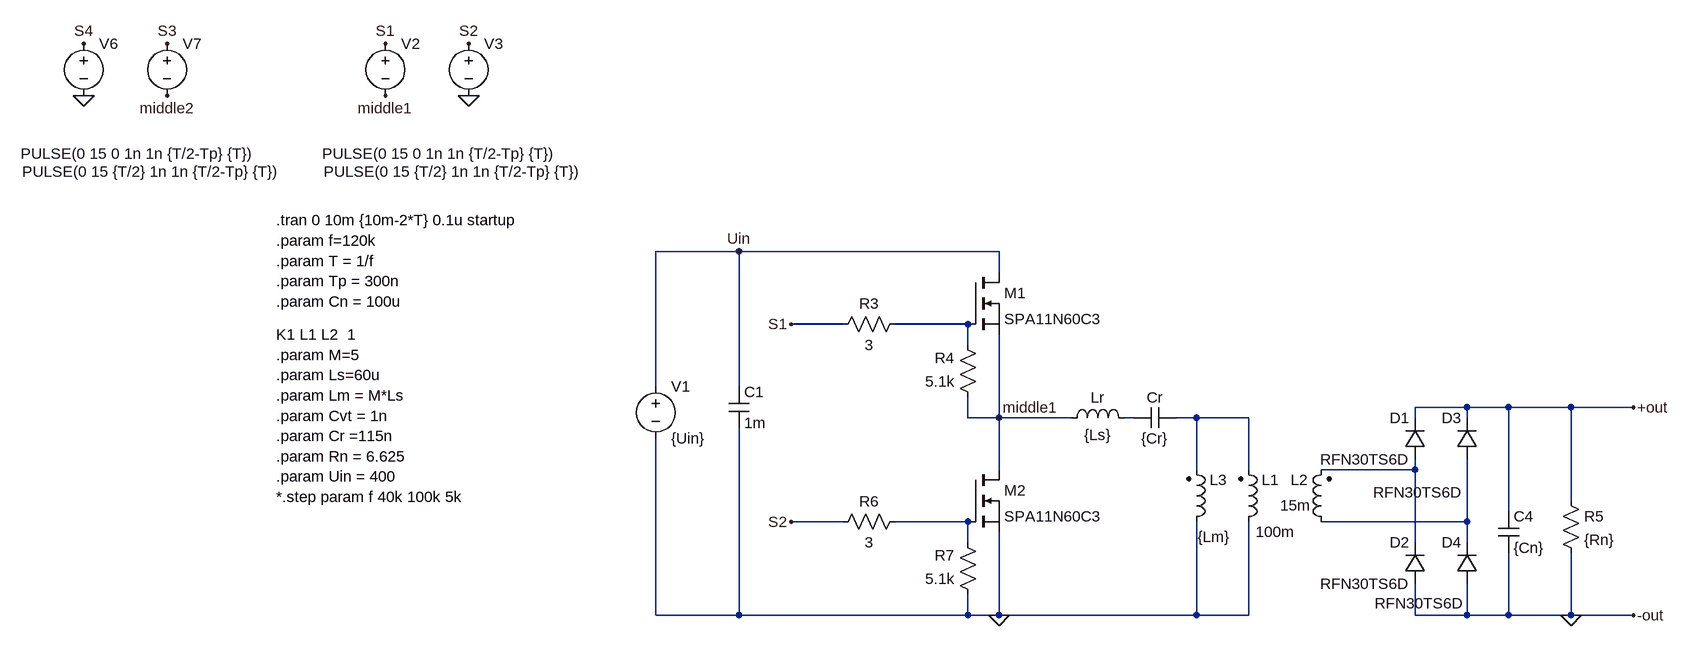
[diagram p0: schematic LLC_skhema.asc]
LLC_skhema.asc, the LTspice schematic file:
Version 4
SHEET 1 1788 964
WIRE -352 -800 -480 -800
WIRE 48 -800 -352 -800
WIRE 48 -768 48 -800
WIRE -192 -688 -272 -688
WIRE 0 -688 -112 -688
WIRE 0 -656 0 -688
WIRE -480 -592 -480 -800
WIRE -352 -592 -352 -800
WIRE 768 -560 688 -560
WIRE 832 -560 768 -560
WIRE 928 -560 832 -560
WIRE 1024 -560 928 -560
WIRE 0 -544 0 -576
WIRE 48 -544 48 -672
WIRE 48 -544 0 -544
WIRE 160 -544 48 -544
WIRE 256 -544 240 -544
WIRE 352 -544 320 -544
WIRE 432 -544 352 -544
WIRE 688 -544 688 -560
WIRE 768 -544 768 -560
WIRE 48 -464 48 -544
WIRE 352 -464 352 -544
WIRE 432 -464 432 -544
WIRE 688 -464 688 -480
WIRE 688 -464 544 -464
WIRE 928 -416 928 -560
WIRE 832 -400 832 -560
WIRE -192 -384 -272 -384
WIRE 0 -384 -112 -384
WIRE 768 -384 768 -480
WIRE 768 -384 544 -384
WIRE 0 -352 0 -384
WIRE 688 -352 688 -464
WIRE 768 -352 768 -384
WIRE -480 -240 -480 -512
WIRE -352 -240 -352 -528
WIRE -352 -240 -480 -240
WIRE 0 -240 0 -272
WIRE 0 -240 -352 -240
WIRE 48 -240 48 -368
WIRE 48 -240 0 -240
WIRE 352 -240 352 -384
WIRE 352 -240 48 -240
WIRE 432 -240 432 -384
WIRE 432 -240 352 -240
WIRE 688 -240 688 -288
WIRE 768 -240 768 -288
WIRE 768 -240 688 -240
WIRE 832 -240 832 -336
WIRE 832 -240 768 -240
WIRE 928 -240 928 -336
WIRE 928 -240 832 -240
WIRE 1024 -240 928 -240
FLAG -896 -1120 S1
FLAG -768 -1120 S2
FLAG -272 -688 S1
FLAG -272 -384 S2
FLAG 48 -544 middle1
FLAG -896 -1040 middle1
FLAG -768 -1040 0
FLAG 48 -240 0
FLAG -352 -800 Uin
FLAG -1360 -1120 S4
FLAG -1232 -1120 S3
FLAG -1232 -1040 middle2
FLAG -1360 -1040 0
FLAG 1024 -560 +out
FLAG 1024 -240 -out
FLAG 928 -240 0
SYMBOL voltage -480 -608 R0
WINDOW 123 0 0 Left 2
WINDOW 39 0 0 Left 2
SYMATTR InstName V1
SYMATTR Value {Uin}
SYMBOL cap -368 -592 R0
SYMATTR InstName C1
SYMATTR Value 1m
SYMBOL ind2 336 -368 M180
WINDOW 0 36 80 Left 2
WINDOW 3 18 -7 Left 2
SYMATTR InstName L3
SYMATTR Value {Lm}
SYMATTR Type ind
SYMBOL ind2 416 -368 M180
WINDOW 0 36 80 Left 2
WINDOW 3 27 0 Left 2
SYMATTR InstName L1
SYMATTR Value 100m
SYMATTR Type ind
SYMBOL ind 144 -528 R270
WINDOW 0 32 56 VTop 2
WINDOW 3 5 56 VBottom 2
SYMATTR InstName Lr
SYMATTR Value {Ls}
SYMBOL voltage -896 -1136 R0
WINDOW 123 0 0 Left 2
WINDOW 39 0 0 Left 2
WINDOW 3 -97 185 Left 2
SYMATTR Value PULSE(0 15 0 1n 1n {T/2-Tp} {T})
SYMATTR InstName V2
SYMBOL voltage -768 -1136 R0
WINDOW 123 0 0 Left 2
WINDOW 39 0 0 Left 2
WINDOW 3 -223 213 Left 2
SYMATTR Value PULSE(0 15 {T/2} 1n 1n {T/2-Tp} {T})
SYMATTR InstName V3
SYMBOL nmos 0 -768 R0
SYMATTR InstName M1
SYMATTR Value SPA11N60C3
SYMBOL cap 320 -560 R90
WINDOW 0 0 32 VBottom 2
WINDOW 3 32 32 VTop 2
SYMATTR InstName Cr
SYMATTR Value {Cr}
SYMBOL res -96 -704 R90
WINDOW 0 0 56 VBottom 2
WINDOW 3 32 56 VTop 2
SYMATTR InstName R3
SYMATTR Value 3
SYMBOL res 16 -560 R180
WINDOW 0 36 76 Left 2
WINDOW 3 36 40 Left 2
SYMATTR InstName R4
SYMATTR Value 5.1k
SYMBOL res -96 -400 R90
WINDOW 0 0 56 VBottom 2
WINDOW 3 32 56 VTop 2
SYMATTR InstName R6
SYMATTR Value 3
SYMBOL res 16 -256 R180
WINDOW 0 36 76 Left 2
WINDOW 3 36 40 Left 2
SYMATTR InstName R7
SYMATTR Value 5.1k
SYMBOL voltage -1360 -1136 R0
WINDOW 123 0 0 Left 2
WINDOW 39 0 0 Left 2
WINDOW 3 -97 185 Left 2
SYMATTR Value PULSE(0 15 0 1n 1n {T/2-Tp} {T})
SYMATTR InstName V6
SYMBOL voltage -1232 -1136 R0
WINDOW 123 0 0 Left 2
WINDOW 39 0 0 Left 2
WINDOW 3 -223 213 Left 2
SYMATTR Value PULSE(0 15 {T/2} 1n 1n {T/2-Tp} {T})
SYMATTR InstName V7
SYMBOL nmos 0 -464 R0
SYMATTR InstName M2
SYMATTR Value SPA11N60C3
SYMBOL ind2 560 -368 R180
WINDOW 0 36 80 Left 2
WINDOW 3 32 41 Left 2
SYMATTR InstName L2
SYMATTR Value 15m
SYMATTR Type ind
SYMBOL res 912 -432 R0
SYMATTR InstName R5
SYMATTR Value {Rn}
SYMBOL cap 816 -400 R0
SYMATTR InstName C4
SYMATTR Value {Cn}
SYMBOL diode 704 -480 R180
WINDOW 0 24 64 Left 2
WINDOW 3 24 0 Left 2
SYMATTR InstName D1
SYMATTR Value RFN30TS6D
SYMBOL diode 704 -288 R180
WINDOW 0 24 64 Left 2
WINDOW 3 24 0 Left 2
SYMATTR InstName D2
SYMATTR Value RFN30TS6D
SYMBOL diode 784 -480 R180
WINDOW 0 24 64 Left 2
WINDOW 3 22 -51 Left 2
SYMATTR InstName D3
SYMATTR Value RFN30TS6D
SYMBOL diode 784 -288 R180
WINDOW 0 24 64 Left 2
WINDOW 3 20 -30 Left 2
SYMATTR InstName D4
SYMATTR Value RFN30TS6D
TEXT -1064 -672 Left 2 !K1 L1 L2  1\n.param M=5\n.param Ls=60u\n.param Lm = M*Ls\n.param Cvt = 1n\n.param Cr =115n\n.param Rn = 6.625\n.param Uin = 400\n*.step param f 40k 100k 5k
TEXT -1064 -848 Left 2 !.tran 0 10m {10m-2*T} 0.1u startup\n.param f=120k\n.param T = 1/f\n.param Tp = 300n\n.param Cn = 100u

The netlist it stands for:
* LLC_skhema.asc
V1 Uin 0 {Uin}
C1 Uin 0 1m
L3 0 N003 {Lm}
L1 0 N003 100m
Lr middle1 N002 {Ls}
V2 S1 middle1 PULSE(0 15 0 1n 1n {T/2-Tp} {T})
V3 S2 0 PULSE(0 15 {T/2} 1n 1n {T/2-Tp} {T})
M1 Uin N001 middle1 middle1 SPA11N60C3
Cr N003 N002 {Cr}
R3 N001 S1 3
R4 middle1 N001 5.1k
R6 N005 S2 3
R7 0 N005 5.1k
V6 S4 0 PULSE(0 15 0 1n 1n {T/2-Tp} {T})
V7 S3 middle2 PULSE(0 15 {T/2} 1n 1n {T/2-Tp} {T})
M2 middle1 N005 0 0 SPA11N60C3
L2 N006 N004 15m
R5 +out 0 {Rn}
C4 +out 0 {Cn}
D1 N004 +out RFN30TS6D
D2 0 N004 RFN30TS6D
D3 N006 +out RFN30TS6D
D4 0 N006 RFN30TS6D
.model D D
.lib standard.dio
.model NMOS NMOS
.model PMOS PMOS
.lib standard.mos
K1 L1 L2  1
.param M=5
.param Ls=60u
.param Lm = M*Ls
.param Cvt = 1n
.param Cr =115n
.param Rn = 6.625
.param Uin = 400
*.step param f 40k 100k 5k
.tran 0 10m {10m-2*T} 0.1u startup
.param f=120k
.param T = 1/f
.param Tp = 300n
.param Cn = 100u
.backanno
.end